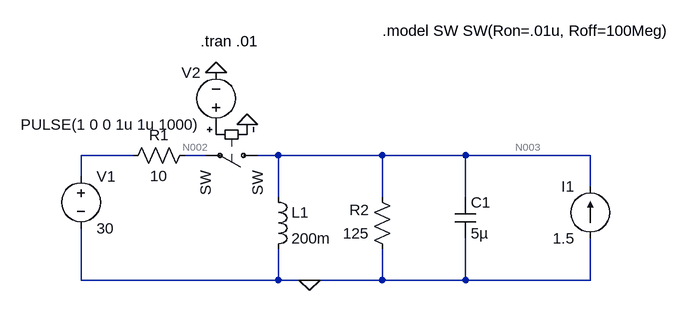
[diagram p0: schematic pas71.asc]
pas71.asc, the LTspice schematic file:
Version 4.1
SHEET 1 976 680
WIRE 112 48 32 48
WIRE 224 48 192 48
WIRE 336 48 304 48
WIRE 496 48 336 48
WIRE 624 48 496 48
WIRE 816 48 624 48
WIRE 32 80 32 48
WIRE 816 96 816 48
WIRE 336 112 336 48
WIRE 496 112 496 48
WIRE 624 112 624 48
WIRE 32 240 32 160
WIRE 336 240 336 192
WIRE 336 240 32 240
WIRE 384 240 336 240
WIRE 496 240 496 192
WIRE 496 240 384 240
WIRE 624 240 624 176
WIRE 624 240 496 240
WIRE 816 240 816 176
WIRE 816 240 624 240
FLAG 288 0 0
FLAG 240 -80 0
FLAG 384 240 0
SYMBOL voltage 32 64 R0
SYMATTR InstName V1
SYMATTR Value 30
SYMBOL res 208 32 R90
WINDOW 0 0 56 VBottom 2
WINDOW 3 32 56 VTop 2
SYMATTR InstName R1
SYMATTR Value 10
SYMBOL res 512 208 R180
WINDOW 0 36 76 Left 2
WINDOW 3 36 40 Left 2
SYMATTR InstName R2
SYMATTR Value 125
SYMBOL ind 320 96 R0
SYMATTR InstName L1
SYMATTR Value 200m
SYMBOL cap 608 112 R0
SYMATTR InstName C1
SYMATTR Value 5µ
SYMBOL current 816 176 R180
WINDOW 0 24 80 Left 2
WINDOW 3 24 0 Left 2
SYMATTR InstName I1
SYMATTR Value 1.5
SYMBOL sw 320 48 R90
SYMATTR InstName SW
SYMBOL voltage 240 16 R180
WINDOW 0 24 96 Left 2
WINDOW 3 24 16 Left 2
WINDOW 123 0 0 Left 0
WINDOW 39 0 0 Left 0
SYMATTR InstName V2
SYMATTR Value PULSE(1 0 0 1u 1u 1000)
TEXT 496 -144 Left 2 !.model SW SW(Ron=.01u, Roff=100Meg)
TEXT 216 -128 Left 2 !.tran .01

The netlist it stands for:
* pas71.asc
V1 N001 0 30
R1 N002 N001 10
R2 0 N003 125
L1 N003 0 200m
C1 N003 0 5µ
I1 0 N003 1.5
SW N003 N002 P001 0 SW
V2 P001 0 PULSE(1 0 0 1u 1u 1000)
.model SW SW(Ron=.01u, Roff=100Meg)
.tran .01
.backanno
.end

* Results of the author's LTspice run, read from the files saved beside the schematic
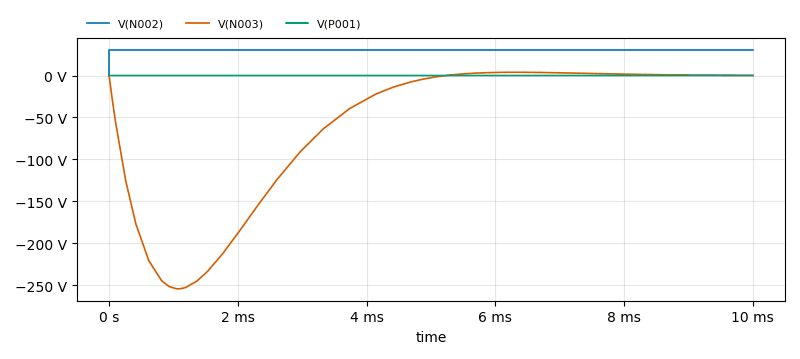
[diagram p1: Transient Analysis of pas71.asc, plotted from the saved traces]
* Transient Analysis, 1 run:
*   V(N002): min 4.5 mV, max 30 V, average 30 V, rms 30 V, last 30 V
*   V(N003): min -254.4 V, max 3.859 V, average -59.93 V, rms 106.1 V, last 95.46 mV
*   V(P001): min 0 V, max 1 V, average 50 µV, rms 7.071 mV, last 0 V